# EAGLE design WSN_Gateway_v3 (EAGLE 8.2.2)
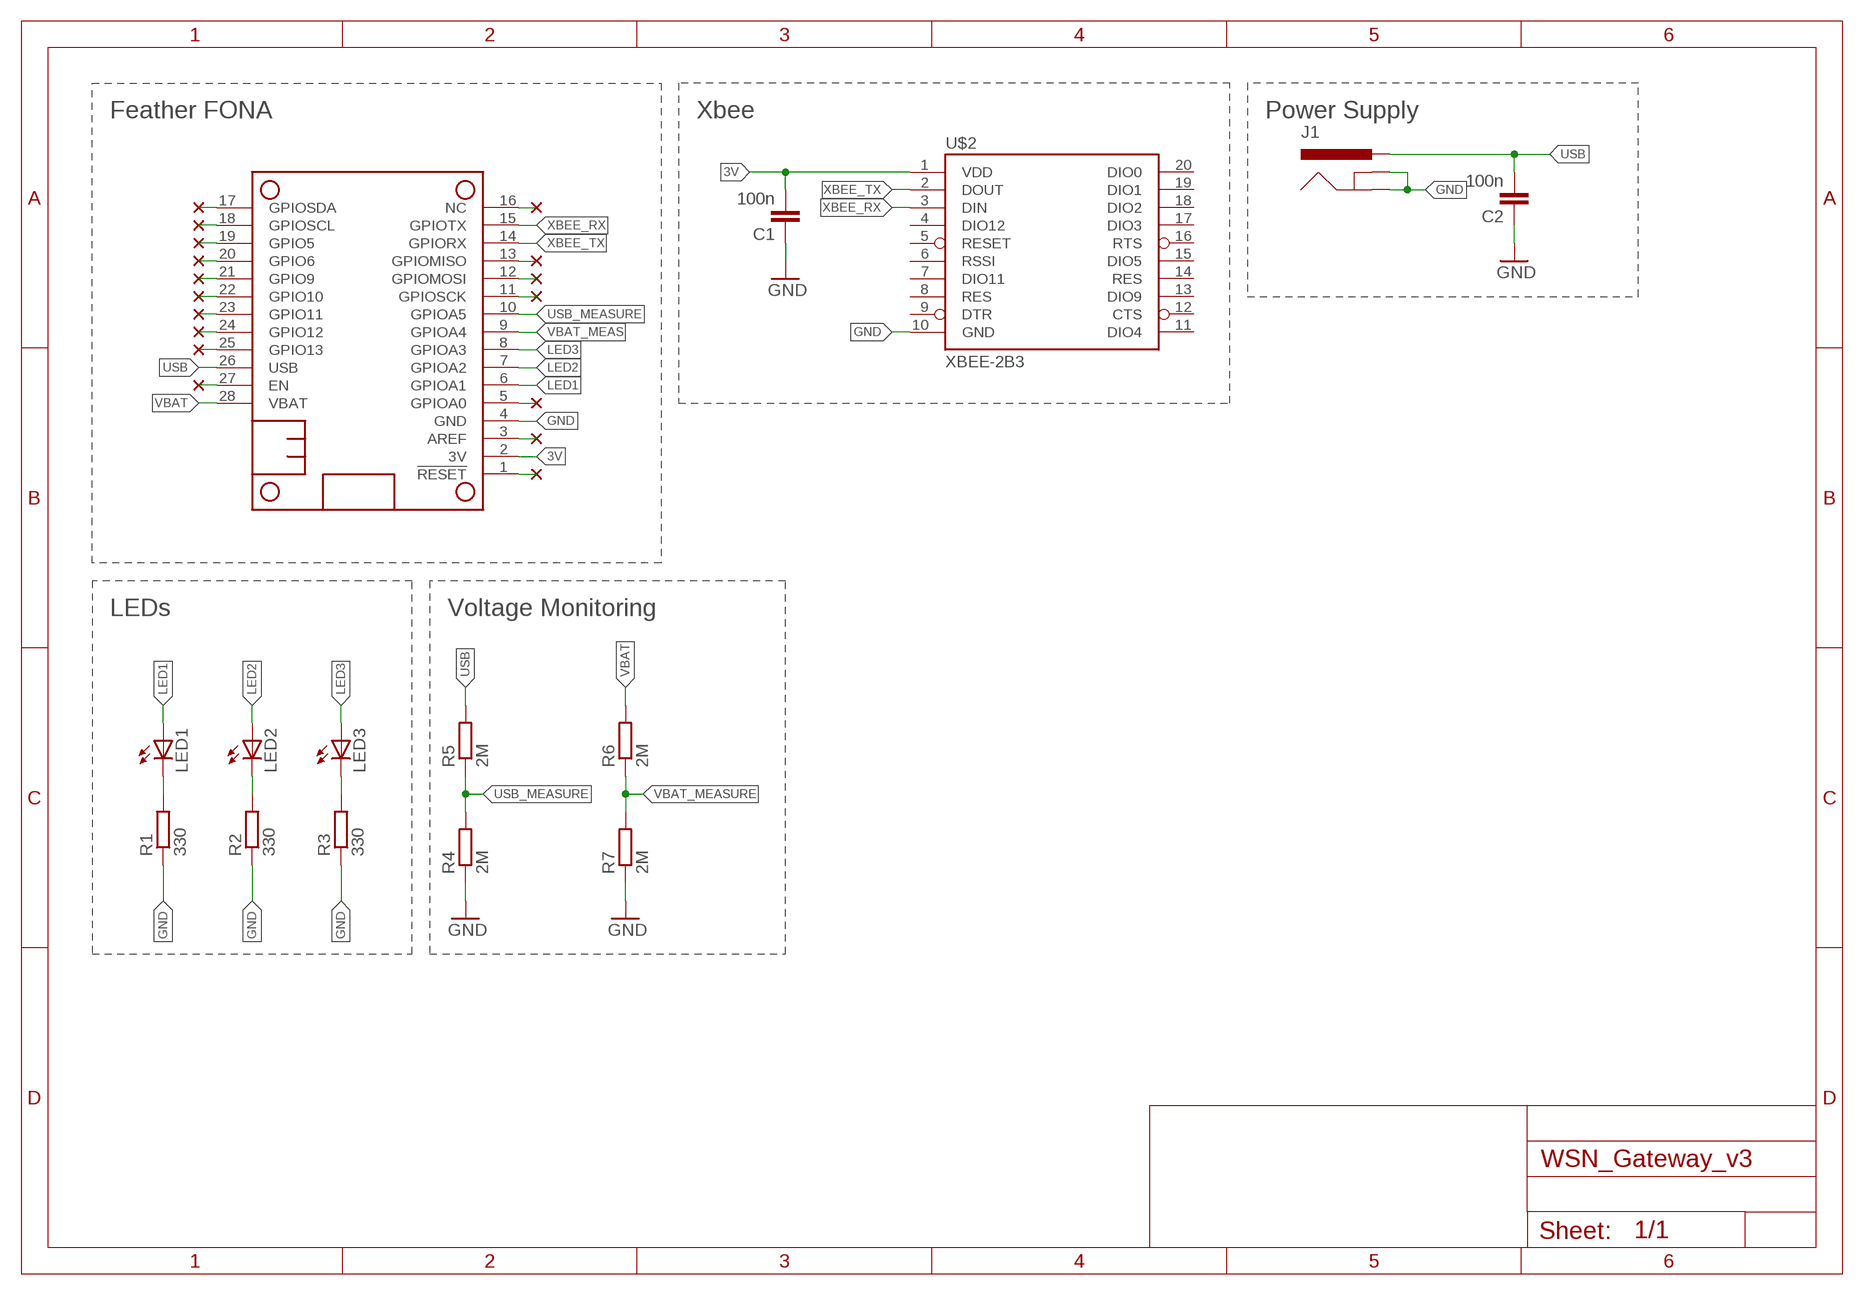
[diagram p0: schematic, sheet 1]

## Parts
C1  100n  C  [C0805]
C2  100n  C  [C0805]
J1  5.5x2.1mm Barrel  POWER_JACKSMD  [POWER_JACK_SMD]
LED1  LEDCHIPLED_0805  [CHIPLED_0805]
LED2  LEDCHIPLED_0805  [CHIPLED_0805]
LED3  LEDCHIPLED_0805  [CHIPLED_0805]
MS1  FEATHERWING_NODIM_NOHOLES  [FEATHERWING_DIM_2]
R1  330  R-EU_R0805  [R0805]
R2  330  R-EU_R0805  [R0805]
R3  330  R-EU_R0805  [R0805]
R4  2M  R-EU_R0805  [R0805]
R5  2M  R-EU_R0805  [R0805]
R6  2M  R-EU_R0805  [R0805]
R7  2M  R-EU_R0805  [R0805]
U$2  XBEE-2B3  [XBEE-SMD]

## Nets
3V: C1.2 MS1.2(3V) U$2.1(VDD)
GND: C1.1 C2.1 J1.GND(GNDBREAK) J1.P$4(GND) MS1.4(GND) R1.1 R2.1 R3.1 R4.1 R7.1 U$2.10(GND)
LED1: LED1.A MS1.6(GPIOA1)
LED2: LED2.A MS1.7(GPIOA2)
LED3: LED3.A MS1.8(GPIOA3)
N$1: LED1.C R1.2
N$2: LED2.C R2.2
N$3: LED3.C R3.2
N$4: MS1.25(GPIO13)
N$5: MS1.24(GPIO12)
N$6: MS1.23(GPIO11)
N$7: MS1.22(GPIO10)
N$8: MS1.21(GPIO9)
N$9: MS1.20(GPIO6)
N$10: MS1.19(GPIO5)
N$11: MS1.18(GPIOSCL)
N$12: MS1.17(GPIOSDA)
N$13: MS1.16(NC)
N$14: MS1.13(GPIOMISO)
N$15: MS1.12(GPIOMOSI)
N$16: MS1.11(GPIOSCK)
N$17: MS1.5(GPIOA0)
N$18: MS1.3(AREF)
N$19: MS1.1(!RESET)
N$20: MS1.27(EN)
USB: C2.2 J1.VIN0(PWR) J1.VIN1(PWR) MS1.26(USB) R5.2
USB_MEASURE: MS1.10(GPIOA5) R4.2 R5.1
VBAT: MS1.28(VBAT) R6.2
VBAT_MEAS: MS1.9(GPIOA4)
VBAT_MEASURE: R6.1 R7.2
XBEE_RX: MS1.15(GPIOTX) U$2.3(DIN)
XBEE_TX: MS1.14(GPIORX) U$2.2(DOUT)
Unconnected: U$2.4(DIO12) U$2.5(RESET) U$2.6(RSSI) U$2.7(DIO11) U$2.8(RES) U$2.9(DTR) U$2.11(DIO4) U$2.12(CTS) U$2.13(DIO9) U$2.14(RES) U$2.15(DIO5) U$2.16(RTS) U$2.17(DIO3) U$2.18(DIO2) U$2.19(DIO1) U$2.20(DIO0)

## Notes on the sheet
- Feather FONA | Xbee | Power Supply
- LEDs | Voltage Monitoring

## Library data of the parts
C1 C2 = wsn:C: CAPACITOR, European symbol; SPICEMODEL: NONE; SPICEPREFIX: C
J1 = wsn:POWER_JACK: Power Jack This is the standard 5.5mm barrel jack for power. The PTH is the most common, proven, reliable, footprint. The Slot footprint only works if the mill layer is transmitted to the PCB fab house so be warned. Mating wall wart : TOL-00298 (and others); PROD_ID: CONN-08106; SF_ID: PRT-12748
LED1-LED3 = adafruit:LED: LED OSRAM: - CHIPLED LG R971, LG N971, LY N971, LG Q971, LY Q971, LO R971, LY R971 LH N974, LH R974 LS Q976, LO Q976, LY Q976 LO Q996 - Hyper CHIPLED LW Q18S LB Q993, LB Q99A, LB R99A - SideLED LS A670, LO A670, LY A670, LG A670, LP A670 LB A673, LV A673, LT A673, LW A673 LH A674 LY A675 LS A676, LA A676, LO A676, LY A676, LW A676 LS A679, LY A679, LG A679 - Hyper Micro SIDELED® LS Y876, LA Y876, LO Y876, LY Y876 LT Y87S - SmartLED LW L88C, LW L88S LB L89C, LB L89S, LG L890 LS L89K, LO L89K, LY L89K LS L896, LA L896, LO L896, LY L896 - TOPLED LS T670, LO T670, LY T670, LG T670, LP T670 LSG T670, LSP T670, LSY T670, LOP T670, LYG T670 LG T671, LOG T671, LSG T671 LB T673, LV T673, LT T673, LW T673 LH T674 LS T676, LA T676, LO T676, LY T676, LB T676, LH T676, LSB T676, LW T676 LB T67C, LV T67C, LT T67C, LS T67K, LO T67K, LY T67K, LW E67C LS E67B, LA E67B, LO E67B, LY E67B, LB E67C, LV E67C, LT E67C LW T67C LS T679, LY T679, LG T679 LS T770, LO T770, LY T770, LG T770, LP T770 LB T773, LV T773, LT T773, LW T773 LH T774 LS E675, LA E675, LY E675, LS T675 LS T776, LA T776, LO T776, LY T776, LB T776 LHGB T686 LT T68C, LB T68C - Hyper Mini TOPLED® LB M676 - Mini TOPLED Santana® LG M470 LS M47K, LO M47K, LY M47K Source: http://www.osram.convergy.de/
MS1 = adafruit:FEATHERWING
R1-R7 = rcl:R-EU_: RESISTOR, European symbol
U$2 = SparkFun-RF:XBEE-2: Xbee module footprints SMT header is CONN-09042.; PROD_ID: CONN-09042

## Board
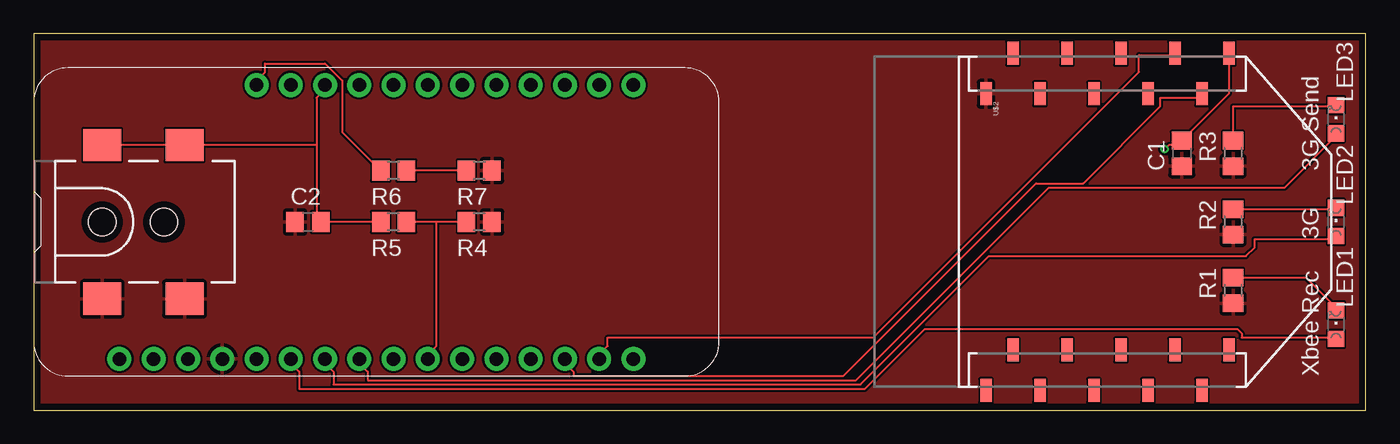
[diagram p1: board, top side]
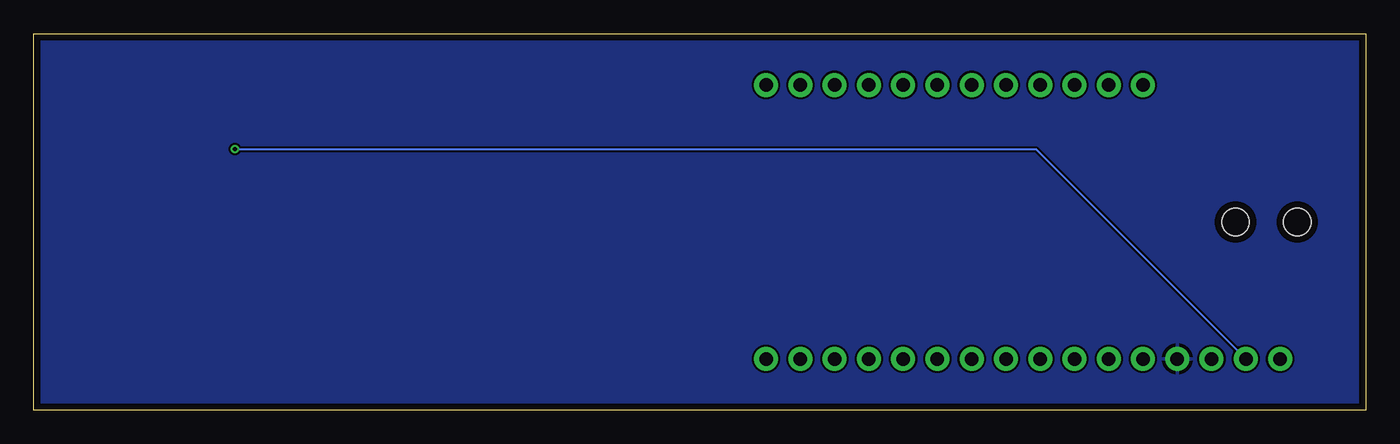
[diagram p2: board, bottom side, seen from below]

Size 98.73 x 27.93 mm. Coordinates in mm from the lower left corner, seen from the top.
Outline: 0,0 98.73,0 98.73,27.93 0,27.93 0,0
Copper layers (1*16): Top 0.035mm / dielectric 1.6mm / Bottom 0.035mm
Design rules "Elecrow_2-layer_PCB_eagle_rule": minimum track width 6mil, minimum drill 12mil, track to track 6mil, track to pad 6mil, pad to pad 6mil, via to via 8mil, smd to smd 0mil, copper to edge 20mil, drill to drill 10mil, minimum pad ring 6mil, minimum via ring 6mil, stop-mask expansion 0mil, vias tented up to drill 100mil, thermal gap 10mil

### Footprints (pad centres in the part's own frame; a part is rotated, then mirrored left to right if it is on the bottom)
C0805 = smd 1.3 x 1.5: 1 -0.95,0; 2 0.95,0
POWER_JACK_SMD = smd 2.8 x 2.4: GND 0,-5.7; P$4 6.1,-5.7; VIN0 0,5.7; VIN1 6.1,5.7 | hole 2.032: 0,0; 4.572,0
CHIPLED_0805 = smd 1.2 x 1.2: A 0,-1.05; C 0,1.05
FEATHERWING_DIM_2 = drill 1 pad 1.778: 1 6.35,1.27; 2 8.89,1.27; 3 11.43,1.27; 4 13.97,1.27; 5 16.51,1.27; 6 19.05,1.27; 7 21.59,1.27; 8 24.13,1.27; 9 26.67,1.27; 10 29.21,1.27; 11 31.75,1.27; 12 34.29,1.27; 13 36.83,1.27; 14 39.37,1.27; 15 41.91,1.27; 16 44.45,1.27; 17 44.45,21.59; 18 41.91,21.59; 19 39.37,21.59; 20 36.83,21.59; 21 34.29,21.59; 22 31.75,21.59; 23 29.21,21.59; 24 26.67,21.59; 25 24.13,21.59; 26 21.59,21.59; 27 19.05,21.59; 28 16.51,21.59
R0805 = smd 1.3 x 1.5: 1 -0.95,0; 2 0.95,0
XBEE-SMD = smd 1.7 x 0.85: 1 -12.5,20; 2 -9.5,18; 3 -12.5,16; 4 -9.5,14; 5 -12.5,12; 6 -9.5,10; 7 -12.5,8; 8 -9.5,6; 9 -12.5,4; 10 -9.5,2; 11 12.5,2; 12 9.5,4; 13 12.5,6; 14 9.5,8; 15 12.5,10; 16 9.5,12; 17 12.5,14; 18 9.5,16; 19 12.5,18; 20 9.5,20

### Placement (x,y rotation side)
C1  85.09,19.05 90 top
C2  20.32,13.97 0 top
J1  5.08,13.97 0 top
LED1  96.52,6.35 0 top
LED2  96.52,13.97 0 top
LED3  96.52,21.59 0 top
MS1  0,2.54 0 top
R1  88.9,8.89 90 top
R2  88.9,13.97 90 top
R3  88.9,19.05 90 top
R4  33.02,13.97 180 top
R5  26.67,13.97 180 top
R6  26.67,17.78 180 top
R7  33.02,17.78 180 top
U$2  68.58,13.97 270 top

### Tracks (layer width: path | path; a pad name or v marks a point on that pad's centre or on a via)
3V  (via drill 0.3)
  Top 0.152: U$2.1 88.58,26.35 88.58,23.5 C1.2 85.09,19.68 84.14,19.68 v83.82,19.37
  Bottom 0.152: MS1.2 24.45,19.37 v83.82,19.37
GND
  pour Bottom: -2.54,30.48 101.6,30.48 101.6,-2.54 -2.54,-2.54
  pour Top: -1.27,29.21 100.33,29.21 100.33,-1.27 -1.27,-1.27
LED1
  Top 0.152: MS1.6 19.05,3.49 19.68,2.86 19.68,1.59 61.59,1.59 66.04,6.03 89.22,6.03 89.53,5.71 89.53,5.4 96.52,5.4 LED1.A
LED2
  Top 0.152: MS1.7 21.59,3.49 22.23,2.86 22.23,1.91 61.28,1.91 70.8,11.43 89.85,11.43 90.49,12.06 90.49,12.7 96.52,12.7 LED2.A
LED3
  Top 0.152: MS1.8 24.13,3.49 24.77,2.86 24.77,2.22 60.96,2.22 75.25,16.51 92.71,16.51 96.52,20.32 LED3.A
N$1
  Top 0.152: LED1.C 96.52,7.62 94.3,9.84 R1.2
N$2
  Top 0.152: LED2.C 96.52,14.92 R2.2
N$3
  Top 0.152: R3.2 88.9,22.54 96.52,22.54 LED3.C
USB
  Top 0.152: J1.VIN0 5.08,19.68 11.11,19.68 J1.VIN1 11.43,19.68 20.95,19.68 | R5.2 C2.2 20.95,13.97 20.95,19.68 | 20.95,19.68 20.95,23.18 21.59,23.81 MS1.26
USB_MEASURE
  Top 0.152: R4.2 29.84,13.97 | 29.84,13.97 R5.1 | 29.84,13.97 29.84,4.76 29.21,4.13 MS1.10
VBAT
  Top 0.152: MS1.28 16.51,24.45 17.14,25.08 17.14,25.72 21.59,25.72 22.86,24.45 22.86,20.64 R6.2
VBAT_MEASURE
  Top 0.152: R7.2 R6.1
XBEE_RX
  Top 0.152: MS1.15 41.91,4.13 42.55,4.76 42.55,5.4 62.23,5.4 81.92,25.08 81.92,26.35 84.45,26.35 U$2.3
XBEE_TX
  Top 0.152: MS1.14 39.37,3.49 40.01,2.86 40.01,2.54 60.01,2.54 74.3,16.83 77.79,16.83 83.5,22.54 83.5,23.18 86.36,23.18 U$2.2

### Text on the board
tPlace: 3G Send | 3G | Xbee Rec